# EAGLE design GDMS (EAGLE 7.5.0)
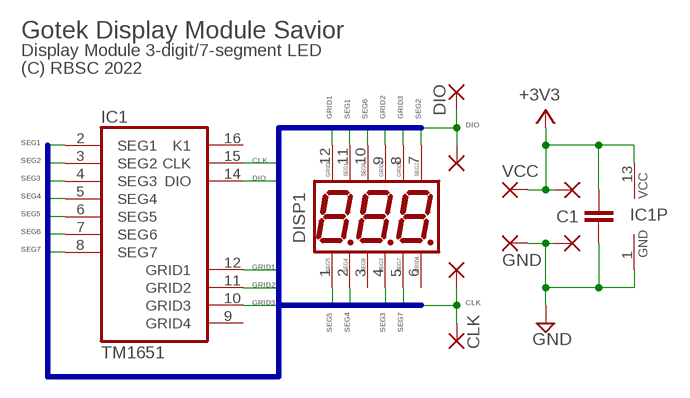
[diagram p0: schematic, sheet 1]

## Parts
C1  100nF  C-EUC0805  [C0805]
DIS1  SP410312N  [3D7SEG]
IC1  TM1651  [SO16]
P1  VCC  PADTH  [PADTH]
P2  PADTH  [PADTH]
P3  GND  PADTH  [PADTH]
P4  PADTH  [PADTH]
P7  CLK  PADTH  [PADTH]
P8  PADTH  [PADTH]
P9  PADTH  [PADTH]
P10  DIO  PADTH  [PADTH]

## Nets
+3V3: C1.1 IC1.13(VCC) P1.1(P) P2.1(P)
CLK: IC1.15(CLK) P7.1(P) P8.1(P)
DIO: IC1.14(DIO) P9.1(P) P10.1(P)
GND: C1.2 IC1.1(GND) P3.1(P) P4.1(P)
GRID1: DIS1.12(GRID1) IC1.12(GRID1)
GRID2: DIS1.9(GRID2) IC1.11(GRID2)
GRID3: DIS1.8(GRID3) IC1.10(GRID3)
SEG1: DIS1.11(SEG1) IC1.2(SEG1)
SEG2: DIS1.7(SEG2) IC1.3(SEG2)
SEG3: DIS1.4(SEG3) IC1.4(SEG3)
SEG4: DIS1.2(SEG4) IC1.5(SEG4)
SEG5: DIS1.1(SEG5) IC1.6(SEG5)
SEG6: DIS1.10(SEG6) IC1.7(SEG6)
SEG7: DIS1.5(SEG7) IC1.8(SEG7)
Unconnected: DIS1.3(SEG8) DIS1.6(GRID4) IC1.9(GRID4) IC1.16(K1)

## Buses
GRID1,GRID2,GRID3,GRID4,SEG1,SEG2,SEG3,SEG4,SEG5,SEG6,SEG7,CLK,DIO

## Notes on the sheet
- Gotek Display Module Savior
- Display Module 3-digit/7-segment LED
- (C) RBSC 2022
- DISP1

## Library data of the parts
C1 = rcl:C-EU: CAPACITOR, European symbol
DIS1 = SP410312N:SP410312N: 3-digit 7-segment LED display
IC1 = tm1651:TM1651: LED Driver
P1-P4 P7-P10 = combopad:PADTH: THROUGH-HOLE PAD

## Board
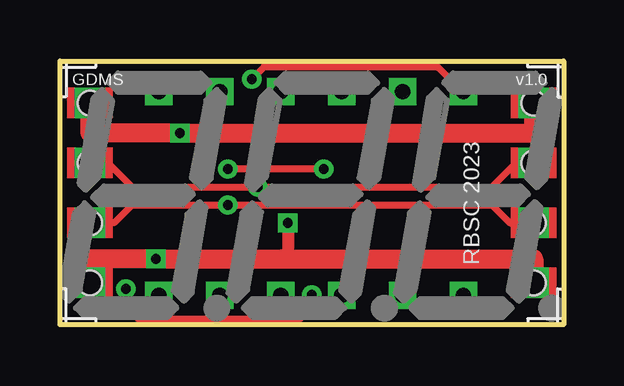
[diagram p1: board, top side]
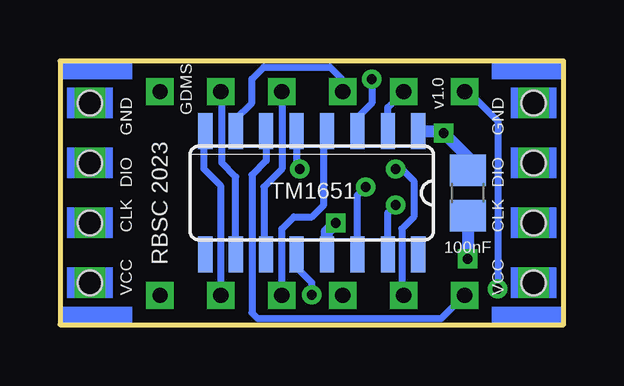
[diagram p2: board, bottom side, seen from below]

Size 21 x 11 mm. Coordinates in mm from the lower left corner, seen from the top.
Outline: 0,0 0,11 21,11 21,0 0,0
Copper layers (1*16): Top 0.035mm / dielectric 1.5mm / Bottom 0.035mm
Design rules "default *": minimum track width 10mil, minimum drill 24mil, track to track 8mil, track to pad 8mil, pad to pad 8mil, via to via 8mil, smd to smd 8mil, copper to edge 40mil, drill to drill 8mil, minimum pad ring 10mil, minimum via ring 8mil, stop-mask expansion 4mil, vias tented up to drill 24mil, thermal gap 10mil

### Footprints (pad centres in the part's own frame; a part is rotated, then mirrored left to right if it is on the bottom)
C0805 = smd 1.3 x 1.5: 1 -0.95,0; 2 0.95,0
3D7SEG = drill 0.635 square: 1 4.128,1.228; 2 6.668,1.228; 3 9.207,1.228; 4 11.748,1.228; 5 14.287,1.228; 6 16.828,1.228; 7 16.828,9.727; 8 14.287,9.727; 9 11.748,9.727; 10 9.207,9.727; 11 6.668,9.727; 12 4.128,9.727
SO16 = smd 0.6 x 1.5: 1 -4.445,-2.573; 2 -3.175,-2.573; 3 -1.905,-2.573; 4 -0.635,-2.573; 5 0.635,-2.573; 6 1.905,-2.573; 7 3.175,-2.573; 8 4.445,-2.573; 9 4.445,2.573; 10 3.175,2.573; 11 1.905,2.573; 12 0.635,2.573; 13 -0.635,2.573; 14 -1.905,2.573; 15 -3.175,2.573; 16 -4.445,2.573
PADTH = drill 0.762 pad 1.27 square: 1 0,0 | hole 1.016: 0,0

### Placement (x,y rotation side)
C1  4,5.5 90 bottom
DIS1  0,0 0 top
IC1  10.5,5.5 180 bottom
P1  1.25,1.75 0 top
P2  19.75,1.75 0 top
P3  1.25,9.25 0 top
P4  19.75,9.25 0 top
P7  1.25,4.25 0 top
P8  19.75,4.25 0 top
P9  1.25,6.75 0 top
P10  19.75,6.75 0 top

### Tracks (layer width: path | path; a pad name or v marks a point on that pad's centre or on a via)
+3V3  (via drill 0.4)
  Top 0.5: 9.25,2.75 9.5,3 v9.5,4.25
  Top 0.8: P2.1 19.75,2.75 9.25,2.75 v4,2.75 1.25,2.75 P1.1
  Bottom 0.5: IC1.13 9.87,3.88 v9.5,4.25 | C1.1 v4,2.75
CLK  (via drill 0.4)
  Top 0.3: P7.1 2.25,4.25 3,5 v7,5 18,5 18.75,4.25 P8.1
  Bottom 0.3: IC1.15 7.33,4.67 v7,5
DIO  (via drill 0.4)
  Top 0.3: P9.1 2,6.75 3,5.75 v8.25,5.75 18,5.75 19,6.75 P10.1
  Bottom 0.3: IC1.14 8.6,5.41 v8.25,5.75
GND  (via drill 0.4)
  Top 0.8: P4.1 19.75,8 v5,8 1.25,8 P3.1
  Bottom 0.5: IC1.1 5.07,8.07 v5,8 4,7 C1.2
GRID1  (via drill 0.4)
  Top 0.3: v2.75,1.5 2.75,0.75 3.25,0.25 10,0.25 10.5,0.75 v10.5,1.25
  Bottom 0.3: IC1.12 11,2.79 11,2.25 10.5,1.75 v10.5,1.25 | DIS1.12 3.98,9.73 2.75,8.5 v2.75,1.5
GRID2
  Bottom 0.3: DIS1.9 11.75,6.5 12.5,5.75 12.5,3.02 IC1.11
GRID3
  Bottom 0.3: IC1.10 13.68,6.17 14.25,6.75 14.25,9.69 DIS1.8
SEG1
  Bottom 0.3: IC1.2 7.33,9.07 DIS1.11
SEG2  (via drill 0.4)
  Top 0.3: DIS1.7 16.77,9.73 15.75,10.75 8.5,10.75 v8,10.25
  Bottom 0.3: v8,10.25 8,9.25 8.75,8.5 8.75,8.23 IC1.3
SEG3
  Bottom 0.3: IC1.4 10,7.94 10,5 10.5,4.5 11.25,4.5 11.75,4 DIS1.4
SEG4  (via drill 0.4)
  Top 0.3: v11,6.5 v7,6.5
  Bottom 0.3: IC1.5 11.13,6.63 v11,6.5 | v7,6.5 6.75,6.5 6.25,6 6.25,4.5 6.75,4 6.75,1.31 DIS1.2
SEG5
  Bottom 0.3: IC1.6 12.4,6.84 13,6.25 13,0.5 12.75,0.25 5.11,0.25 DIS1.1
SEG6
  Bottom 0.3: IC1.7 13.68,8.57 13,9.25 13,10.25 12.5,10.75 9.75,10.75 9.25,10.25 9.25,9.77 DIS1.10
SEG7
  Bottom 0.3: DIS1.5 14.29,5.79 15,6.5 15,8.02 IC1.8
(copper drawn outside any net)
  shapes: Bottom area x4

### Text on the board
tNames: GDMS | v1.0 | RBSC 2023
bNames: GND | GND | v1.0 | GDMS | DIO | DIO | CLK | TM1651 | CLK | VCC | 100nF | VCC | RBSC 2023